# EAGLE design SparkFun_ENS160_BME280_Breakout (EAGLE 9.6.2)
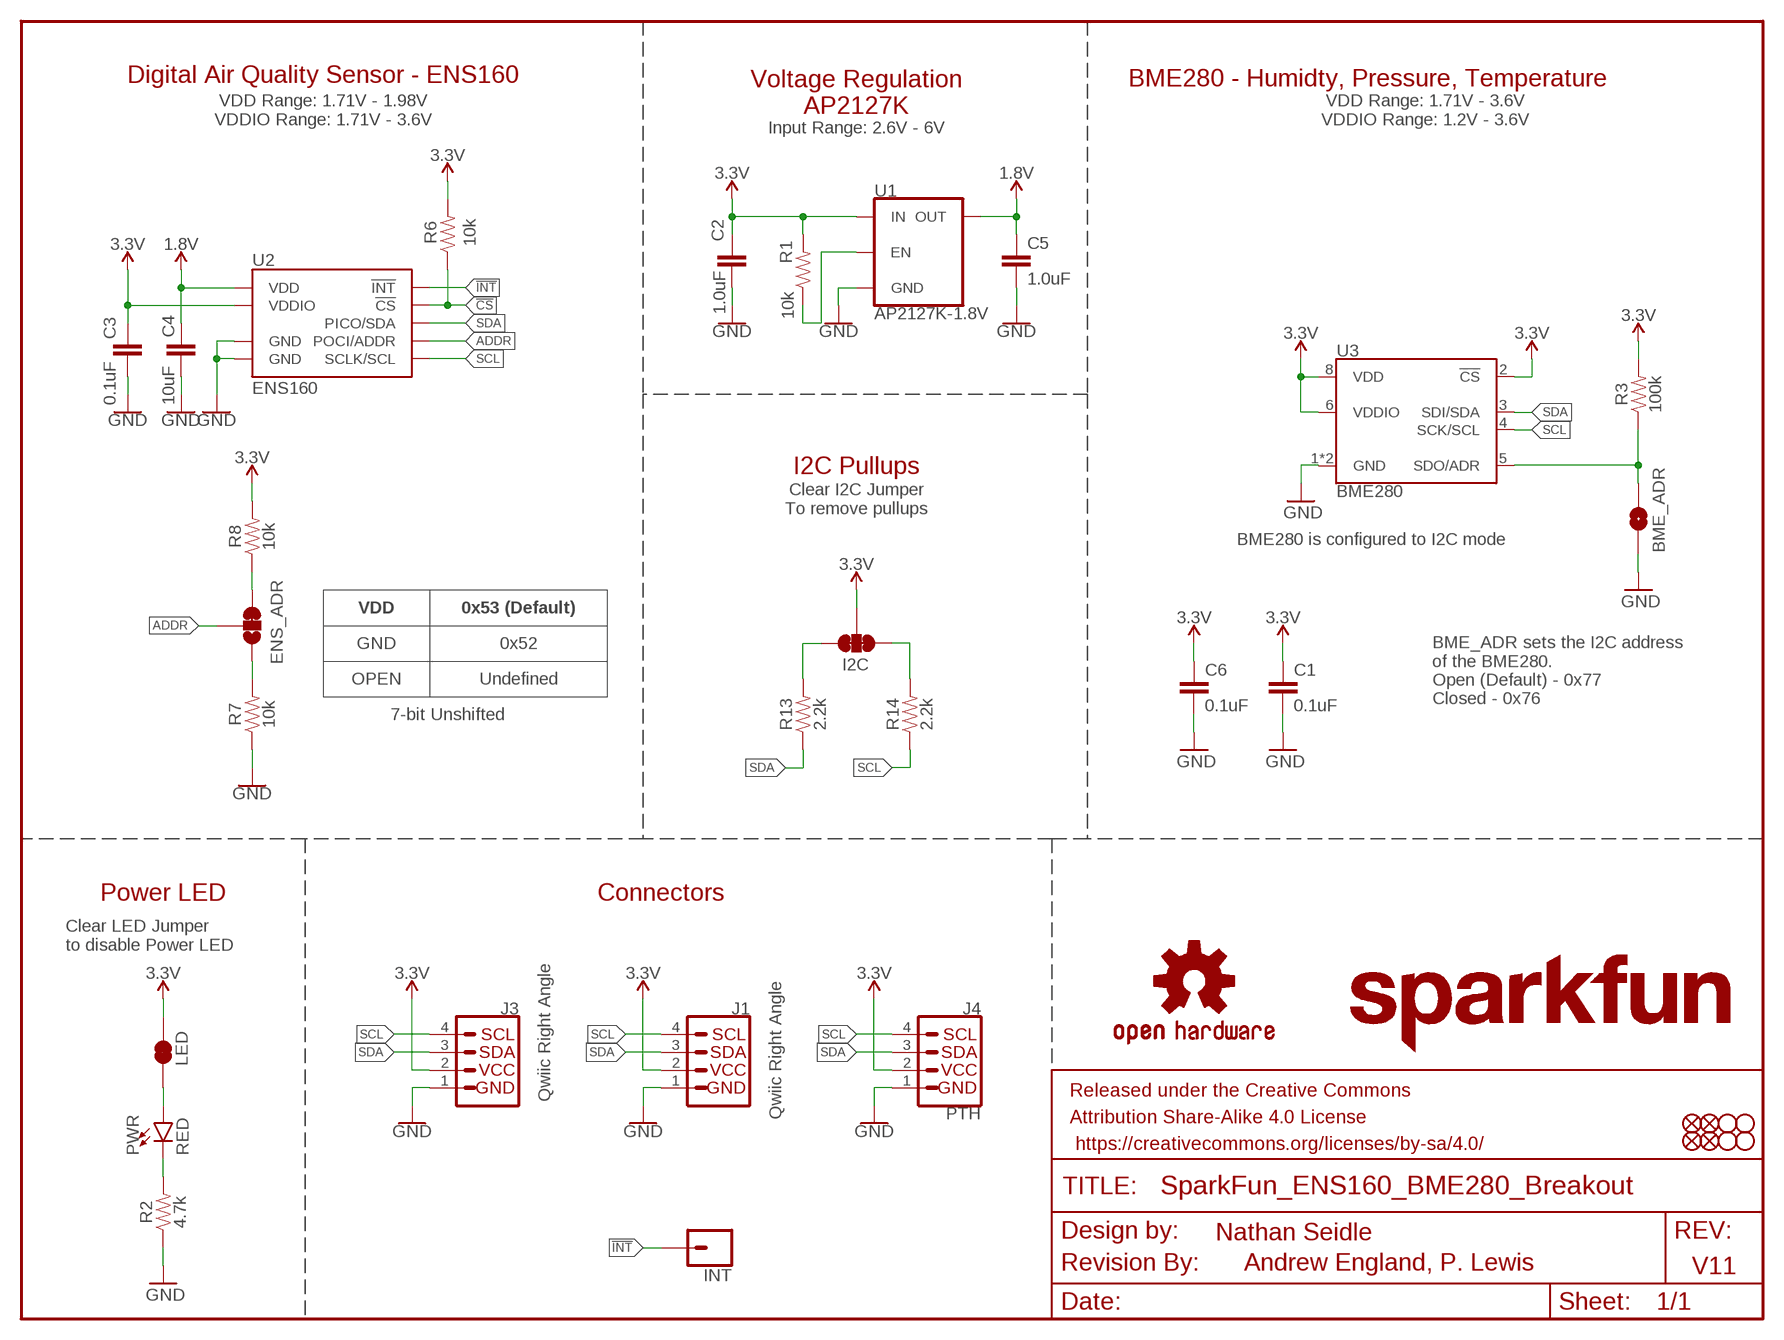
[diagram p0: schematic, sheet 1]

## Parts
BME_ADR  JUMPER-SMT_2_NO_SILK  [SMT-JUMPER_2_NO_SILK]
C1  0.1uF  0.1UF-0402T-16V-10%  [0402-TIGHT]
C2  1.0uF  1.0UF-0402T-16V-10%  [0402-TIGHT]
C3  0.1uF  0.1UF-0402T-16V-10%  [0402-TIGHT]
C4  10uF  10UF-0402T-6.3V-20%  [0402-TIGHT]
C5  1.0uF  1.0UF-0402T-16V-10%  [0402-TIGHT]
C6  0.1uF  0.1UF-0402T-16V-10%  [0402-TIGHT]
ENS_ADR  JUMPER-SMT_3_1-NC_TRACE_SILK  [SMT-JUMPER_3_1-NC_TRACE_SILK]
FD1  FIDUCIAL1X2  [FIDUCIAL-1X2]
FD2  FIDUCIAL1X2  [FIDUCIAL-1X2]
FD3  FIDUCIAL1X2  [FIDUCIAL-1X2]
FD4  FIDUCIAL1X2  [FIDUCIAL-1X2]
FRAME1  FRAME-LETTER  [CREATIVE_COMMONS]
H1  STAND-OFF  [STAND-OFF]
H2  STAND-OFF  [STAND-OFF]
H3  STAND-OFF  [STAND-OFF]
H4  STAND-OFF  [STAND-OFF]
I2C  JUMPER-SMT_3_2-NC_TRACE_SILK  [SMT-JUMPER_3_2-NC_TRACE_SILK]
INT  CONN_01PTH_NO_SILK_STAND  [1X01_NO_SILK_STAND]
J1  Qwiic Right Angle  I2C_STANDARDQWIIC  [JST04_1MM_RA]
J3  Qwiic Right Angle  I2C_STANDARDQWIIC  [JST04_1MM_RA]
J4  PTH  I2C_STANDARD_NO_SILK  [1X04_NO_SILK]
LED  JUMPER-SMT_2_NC_TRACE_SILK  [SMT-JUMPER_2_NC_TRACE_SILK]
LOGO1  SFE_LOGO_NAME.1_INCH  [SFE_LOGO_NAME_.1]
LOGO2  REVISION  [REVISION]
LOGO4  OSHW-LOGOS  [OSHW-LOGO-S]
PWR  RED  LED-RED_0603-KB  [LED-0603]
R1  10k  10KOHM-0402T-1/16W-1%  [0402-TIGHT]
R2  4.7k  4.7KOHM-0402T-1/16W-1%  [0402-TIGHT]
R3  100k  100KOHM-0402T-1/16W-1%  [0402-TIGHT]
R6  10k  10KOHM-0402T-1/16W-1%  [0402-TIGHT]
R7  10k  10KOHM-0402T-1/16W-1%  [0402-TIGHT]
R8  10k  10KOHM-0402T-1/16W-1%  [0402-TIGHT]
R13  2.2k  2.2KOHM-0402T-1/16W-1%  [0402-TIGHT]
R14  2.2k  2.2KOHM-0402T-1/16W-1%  [0402-TIGHT]
U1  AP2127K-1.8V  V_REG_AP2127K-1.8V  [SOT23-5]
U2  ENS160  ENS-160  [LGA-9]
U3  BME280  [LGA-8-2.5X2.5]

## Nets
1.8V: C4.1 C5.1 U1.5(OUT) U2.P4(VDD)
3.3V: C1.1 C2.1 C3.1 C6.1 I2C.2 J1.2 J3.2 J4.2 LED.1 R1.2 R3.2 R6.2 R8.2 U1.1(IN) U2.P5(VDDIO) U3.2(!CS) U3.6(VDDIO) U3.8(VDD)
!CS!: R6.1 U2.P7(!CS!)
!INT!: INT.1 U2.P6(!INT!)
ADDR: ENS_ADR.2 U2.P3(POCI/ADDR)
GND: BME_ADR.1 C1.2 C2.2 C3.2 C4.2 C5.2 C6.2 J1.1 J3.1 J4.1 R2.1 R7.1 U1.2(GND) U2.P8(GND) U2.P9(GND) U3.1(GND) U3.7(GND)
N$2: ENS_ADR.3 R8.1
N$3: R1.1 U1.3(EN)
N$4: I2C.3 R13.2
N$5: I2C.1 R14.2
N$6: PWR.C R2.2
N$7: ENS_ADR.1 R7.2
N$8: LED.2 PWR.A
SCL: J1.4 J3.4 J4.4 R14.1 U2.P2(SCLK/SCL) U3.4(SCK/SCL)
SDA: J1.3 J3.3 J4.3 R13.1 U2.P1(PICO/SDA) U3.3(SDI/SDA)
SDO/ADR: BME_ADR.2 R3.1 U3.5(SDO/ADR)

## Notes on the sheet
- Digital Air Quality Sensor - ENS160
- BME280 - Humidty, Pressure, Temperature
- Voltage Regulation
  AP2127K
- VDD Range: 1.71V - 1.98V
  VDDIO Range: 1.71V - 3.6V
- VDD Range: 1.71V - 3.6V
  VDDIO Range: 1.2V - 3.6V
- Input Range: 2.6V - 6V
- I2C Pullups
- Clear I2C Jumper
  To remove pullups
- BME280 is configured to I2C mode
- VDD | 0x53 (Default)
- BME_ADR sets the I2C address
  of the BME280.
  Open (Default) - 0x77
  Closed - 0x76
- GND | 0x52
- OPEN | Undefined
- 7-bit Unshifted
- Power LED | Connectors
- Clear LED Jumper 
  to disable Power LED
- Nathan Seidle
- Andrew England, P. Lewis | V11

## Library data of the parts
BME_ADR = SparkFun-Jumpers:JUMPER-SMT_2_NO: Normally open jumper This jumper has two pads in close proximity to each other. Apply solder to close the connection. Round pads are easier to solder for beginners, but are a lot larger. SparkFun Product that uses the round pads: SparkFun EL Sequencer <https://www.sparkfun.com/products/12781>
C1 C3 C6 = SparkFun-Capacitors:0.1UF: 0.1µF ceramic capacitors A capacitor is a passive two-terminal electrical component used to store electrical energy temporarily in an electric field.; PROD_ID: CAP-12416
C2 C5 = SparkFun-Capacitors:1.0UF: 1µF ceramic capacitors A capacitor is a passive two-terminal electrical component used to store electrical energy temporarily in an electric field.; PROD_ID: CAP-12417
C4 = SparkFun-Capacitors:10UF: 10.0µF ceramic capacitors A capacitor is a passive two-terminal electrical component used to store electrical energy temporarily in an electric field.; PROD_ID: CAP-14848
ENS_ADR = SparkFun-Jumpers:JUMPER-SMT_3_1-NC_TRACE: Normally closed trace jumper (1 of 2 connections) This jumper has a trace between two pads so it's normally closed (NC). The other connection is normally open (NO). Use a razor knife to open the connection. For best results follow the IPC guidelines for cutting traces: Cutout at least 0.063 mm (0.005 in). Remove all loose material to clean up the cut area. Seal the cut with an approved epoxy. Reapply solder to reclose the connection, or to close the NO connection.
FD1-FD4 = SparkFun-Aesthetics:FIDUCIAL: Fiducial Alignment Points Point-of-reference for pick-and-place machines and other optical instruments.
FRAME1 = SparkFun-Aesthetics:FRAME-LETTER: Schematic Frame - Letter Standard 8.5x11 US Letter frame
H1-H4 = SparkFun-Hardware:STAND-OFF: Stand Off Drill holes for mechanically mounting via screws, standoffs, etc. Note: Use the keepout ring to avoid running the screw head into surrounding components. Variant Overviews STAND-OFF - Mechanical footprint for a #4 phillips button head screw. STAND-OFF-TIGHT - Mechanical footprint for a #4 phillips button head screw, Example SparkFun Products Screw - Phillips Head (1/4", 4-40, 10 pack) <https://www.sparkfun.com/products/10453> (PRT-10453) Screw - Phillips Head (1/2", 4-40, 10 pack) <https://www.sparkfun.com/products/10452> (PRT-10452) Screw - Phillips Head (3/4", 4-40, 10 pack) <https://www.sparkfun.com/products/10451> (PRT-10451) Screw - Phillips Head (1", 4-40, 10 pack) <https://www.sparkfun.com/products/10450> (PRT-10450)
I2C = SparkFun-Jumpers:JUMPER-SMT_3_2-NC_TRACE: Normally closed trace jumper (2 of 2 connections) This jumper has a trace between all three pads so they are normally closed (NC). Use a razor knife to open the connection(s). For best results follow the IPC guidelines for cutting traces: Cutout at least 0.063 mm (0.005 in). Remove all loose material to clean up the cut area. Seal the cut with an approved epoxy. Reapply solder to reclose the connection(s).
INT = SparkFun-Connectors:CONN_01: Single connection point. Often used as Generic Header-pin footprint for 0.1 inch spaced/style header connections On any of the 0.1 inch spaced packages, you can populate with these: Break Away Headers - Straight <https://www.sparkfun.com/products/116> (PRT-00116) Break Away Male Headers - Right Angle <https://www.sparkfun.com/products/553> (PRT-00553) Female Headers <https://www.sparkfun.com/products/115> (PRT-00115) Break Away Headers - Machine Pin <https://www.sparkfun.com/products/117> (PRT-00117) Break Away Female Headers - Swiss Machine Pin <https://www.sparkfun.com/products/743> (PRT-00743) This device is also useful as a general connection point to wire up your design to another part of your project. Our various solder wires solder well into these plated through hole pads. Hook-Up Wire - Assortment (Stranded, 22 AWG) <https://www.sparkfun.com/products/11375> (PRT-11375) Hook-Up Wire - Assortment (Solid Core, 22 AWG) <https://www.sparkfun.com/products/11367> (PRT-11367) View the entire wire category on our website here <https://www.sparkfun.com/categories/141> Special notes: SMTSO-256-ET is a "flush mount" nut for a 4-40 screw. We mostly use this on specialty testbeds; it is a nice way to connect hardware to your PCB at an adjustable hieght. Also note, the SNAP packages are for using a snappable style connector. We sell a baggie of snaps and they are also used on two LilyPad designs: Snap Assortment - 30 pack (male and female) <https://www.sparkfun.com/products/11347> (DEV-11347) LilyPad Arduino SimpleSnap <https://www.sparkfun.com/products/10941> (DEV-10941) LilyPad SimpleSnap Protoboard <https://www.sparkfun.com/products/10940> (DEV-10940)
J1 J3 = SparkFun-Connectors:I2C_STANDARD: SparkFun I2C Standard Pinout Header SparkFun has standardized on a pinout for all I2C based sensor breakouts. This pinout allows I2C boards to be plugged directly into the headers on Arduino Uno compatible boards, and to be daisy chained easily. Example SparkFun Products: SparkFun Atmospheric Sensor Breakout - BME280 <https://www.sparkfun.com/products/13676> SparkFun Altitude/Pressure Sensor Breakout - MPL3115A2 <https://www.sparkfun.com/products/11084> SparkFun TOF Range Finder Sensor - VL6180 <https://www.sparkfun.com/products/12785>; PROD_ID: CONN-13694
J4 = SparkFun-Connectors:I2C_STANDARD: SparkFun I2C Standard Pinout Header SparkFun has standardized on a pinout for all I2C based sensor breakouts. This pinout allows I2C boards to be plugged directly into the headers on Arduino Uno compatible boards, and to be daisy chained easily. Example SparkFun Products: SparkFun Atmospheric Sensor Breakout - BME280 <https://www.sparkfun.com/products/13676> SparkFun Altitude/Pressure Sensor Breakout - MPL3115A2 <https://www.sparkfun.com/products/11084> SparkFun TOF Range Finder Sensor - VL6180 <https://www.sparkfun.com/products/12785>
LED = SparkFun-Jumpers:JUMPER-SMT_2_NC_TRACE: Normally closed trace jumper This jumper has a trace between two pads so it's normally closed (NC). Use a razor knife to open the connection. For best results follow the IPC guidelines for cutting traces: Cutout at least 0.063 mm (0.005 in). Remove all loose material to clean up the cut area. Seal the cut with an approved epoxy. Reapply solder to reclose the connection.
LOGO1 = SparkFun-Aesthetics:SFE_LOGO_NAME: SparkFun Font Logo This is the SparkFun name logo. The logo on the schematic will always be the same size; the package variant is the height of the flame part of the logo (or the height the flame would be, if it were drawn). Default layer for the logo on the board is tSilk.
LOGO2 = SparkFun-Aesthetics:REVISION: "Revision By" Text Preceding text for revisor documentation. Includes schematic text on "symbols" layer, and board text on tDoc.
LOGO4 = SparkFun-Aesthetics:OSHW-LOGO: Open-Source Hardware (OSHW) Logo This logo indicates the piece of hardware it is found on incorporates a OSHW license and/or adheres to the definition of open source hardware found here: http://freedomdefined.org/OSHW
PWR = SparkFun-LED:LED-RED: Red SMD LED Used in manufacturing of most products at SparkFun Packages: 0603 - KB - KingBright (DIO-17976) SMD 0603 package [Datasheet] <https://www.kingbrightusa.com/images/catalog/SPEC/APT1608SURCK.pdf> 0603 - (DIO-00819, has gone EOL) SMD 0603 package 0603 SMART - SMD 0603 SMART package ( more efficient and expensive)[Product Link] <http://www.osram-os.com/Graphics/XPic2/00077099_0.pdf> 1206 - SMD1206 package [Product Link] <https://www.sparkfun.com/datasheets/DevTools/LilyPad/Q150OVS4.pdff> SparkFun Products: Pro Mini 328 -5V <https://www.sparkfun.com/products/821> RedBoard <https://www.sparkfun.com/products/12757> IOIO-OTG <https://www.sparkfun.com/products/13613>; PROD_ID: DIO-17976
R1 R6-R8 = SparkFun-Resistors:10KOHM: 10kΩ resistor A resistor is a passive two-terminal electrical component that implements electrical resistance as a circuit element. Resistors act to reduce current flow, and, at the same time, act to lower voltage levels within circuits. - Wikipedia; PROD_ID: RES-14241
R2 = SparkFun-Resistors:4.7KOHM: 4.7kΩ resistor A resistor is a passive two-terminal electrical component that implements electrical resistance as a circuit element. Resistors act to reduce current flow, and, at the same time, act to lower voltage levels within circuits. - Wikipedia; PROD_ID: RES-15343
R3 = SparkFun-Resistors:100KOHM: 100kΩ resistor A resistor is a passive two-terminal electrical component that implements electrical resistance as a circuit element. Resistors act to reduce current flow, and, at the same time, act to lower voltage levels within circuits. - Wikipedia; PROD_ID: RES-13495
R13 R14 = SparkFun-Resistors:2.2KOHM: 2.2kΩ resistor A resistor is a passive two-terminal electrical component that implements electrical resistance as a circuit element. Resistors act to reduce current flow, and, at the same time, act to lower voltage levels within circuits. - Wikipedia; PROD_ID: RES-14341
U1 = SparkFun-IC-Power:V_REG_AP2127: AP2127 - 300mA CMOS LDO Regulator w/ Enable The AP2127 is CMOS process low dropout linear regulator with enable function, the regulator delivers a guaranteed 300mA (min.) continuous load current. Features Output Voltage Accuracy: ±1.5% Output Current: 300mA (Min.) Foldback Short Current Protection: 50mA Enable Function to Turn ON/OFF VOUT Low Dropout Voltage (3.3V): 250mV (Typ.) @IOUT=600mA Excellent Load Regulation: 0.2%/A (Typ.) Excellent Line Regulation: 0.02%/V (Typ.) Low Quiescent Current: 55μA (Typ.) Low Standby Current: 0.01μA (Typ.) Low Output Noise: 50μVRMS PSRR: 100Hz -65dB, 1kHz -65dB OTSD Protection Stable with 1.0μF Flexible Cap: Ceramic, Tantalum and Aluminum Electrolytic Operation Temperature Range: -40°C to 85°C ESD: MM 400V, HBM 4000V; PROD_ID: VREG-14239
U2 = SparkFun-Sensors:ENS-160: ScioSense Indoor Air Quality Sensor - ENS160 The ENS160 is a digital multi-gas sensor solution, based on metal oxide (MOX) technology with four sensor elements. The independent hotplate control allows the detection of a wide range of volatile organic compounds (VOCs) including ethanol, toluene, hydrogen and oxidizing gases with superior sensitivity. The ENS160 supports intelligent algorithms to process raw sensor measurements on-chip. These algorithms calculate CO2-equivalents, TVOC, air quality indices (AQIs) and perform humidity and temperature compensation, as well as baseline management, all on chip.; PROD_ID: IC-17100
U3 = SparkFun-Sensors:BME280: Bosch BME280 – Combined Humidity and Pressure Sensor The BME280 is as combined digital humidity, pressure and temperature sensor based on proven sensing principles. The sensor module is housed in an extremely compact metal-lid LGA package with a footprint of only 2.5×2.5mm² with a height of 0.93mm. Its small dimensions and its low power consumption allow the implementation in battery driven devices such as handsets, GPS modules or watches. Datasheet <https://cdn.sparkfun.com/assets/learn_tutorials/4/1/9/BST-BME280_DS001-10.pdf> SparkFun Products SparkFun Atmospheric Sensor Breakout - BME280 <https://www.sparkfun.com/products/13676> (SEN-13676); PROD_ID: IC-13090

## Board
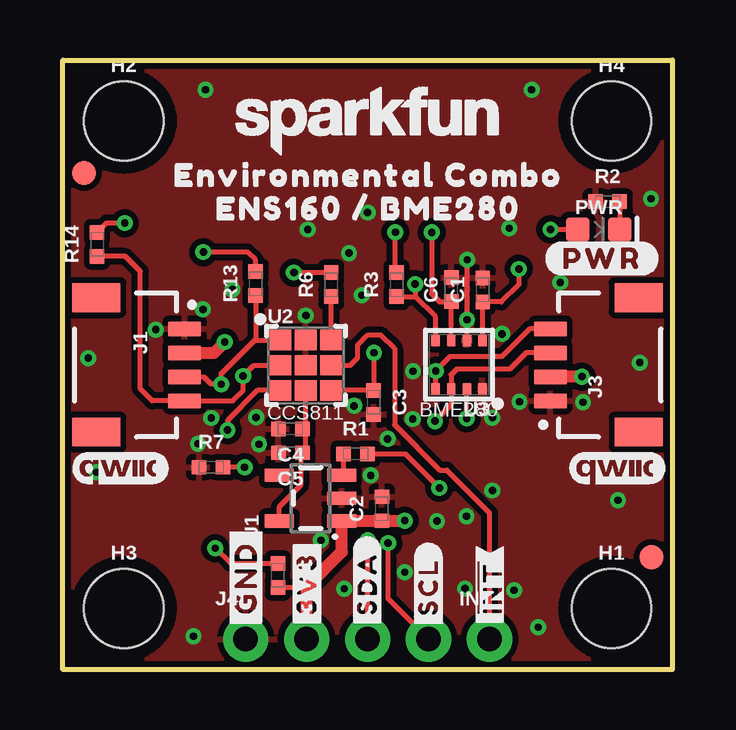
[diagram p1: board, top side]
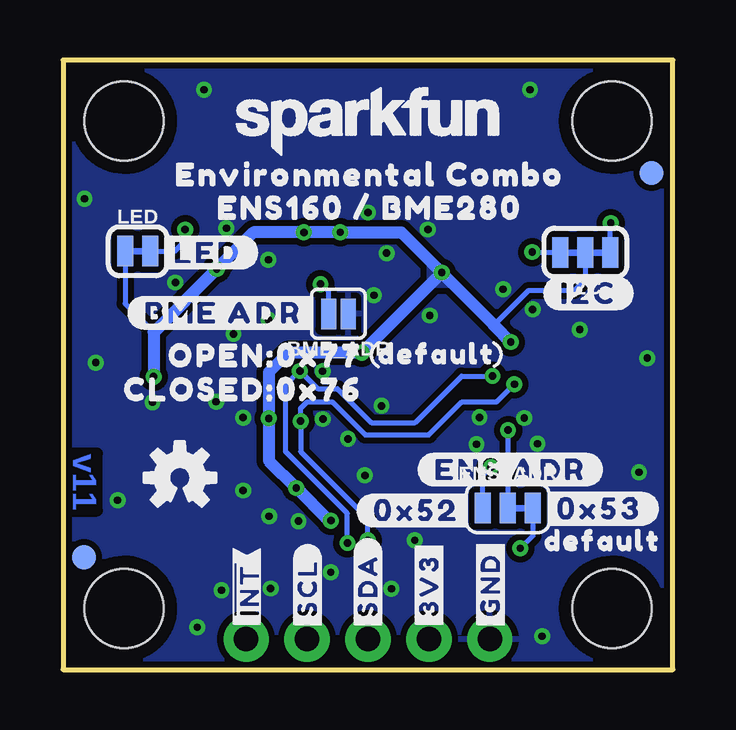
[diagram p2: board, bottom side, seen from below]

Size 25.4 x 25.4 mm. Coordinates in mm from the lower left corner, seen from the top.
Outline: 0,0 0,25.4 25.4,25.4 25.4,0 0,0
Copper layers (1*16): Top 0.035mm / dielectric 1.5mm / Bottom 0.035mm
Design rules "SparkFun-2-Layer-General-JLCPCB": minimum track width 7mil, minimum drill 0.3mm, track to track 7mil, track to pad 7mil, pad to pad 7mil, via to via 7mil, smd to smd 7mil, copper to edge 7mil, drill to drill 7mil, minimum pad ring 7mil, minimum via ring 7mil, stop-mask expansion 3mil, vias tented up to drill 25mil, thermal gap 10mil

### Footprints (pad centres in the part's own frame; a part is rotated, then mirrored left to right if it is on the bottom)
SMT-JUMPER_2_NO_SILK = smd 0.635 x 1.27: 1 -0.406,0; 2 0.406,0
0402-TIGHT = smd 0.6 x 0.6: 1 -0.5,0; 2 0.5,0
SMT-JUMPER_3_1-NC_TRACE_SILK = smd 0.66 x 1.27: 1 -1.041,0; 2 0,0; 3 1.041,0
FIDUCIAL-1X2 = smd 1 x 1: 1 0,0
STAND-OFF = hole 3.302: 0,0
SMT-JUMPER_3_2-NC_TRACE_SILK = smd 0.66 x 1.27: 1 -1.041,0; 2 0,0; 3 1.041,0
1X01_NO_SILK_STAND = drill 1.016 pad 1.88: 1 0,0
JST04_1MM_RA = smd 0.6 x 1.35: 1 -1.5,0; 2 -0.5,0; 3 0.5,0; 4 1.5,0 | smd 1.2 x 2: NC1 2.8,-3.675; NC2 -2.8,-3.675
1X04_NO_SILK = drill 1.016 pad 1.88: 1 0,0; 2 2.54,0; 3 5.08,0; 4 7.62,0
SMT-JUMPER_2_NC_TRACE_SILK = smd 0.66 x 1.27: 1 -0.521,0; 2 0.521,0
LED-0603 = smd 1 x 1: A -0.877,0; C 0.877,0
SOT23-5 = smd 0.55 x 1.2: 1 -0.95,-1.3; 2 0,-1.3; 3 0.95,-1.3; 4 0.95,1.3; 5 -0.95,1.3
LGA-9 = smd 0.9 x 0.85: P1 -1.085,1.03; P2 -1.085,-0.02; P3 -1.085,-1.07; P4 -0.035,-1.07; P5 1.015,-1.07; P6 1.015,-0.02; P7 1.015,1.03; P8 -0.035,1.03; P9 -0.035,-0.02
LGA-8-2.5X2.5 = smd 0.35 x 0.5: 1 -0.975,1.025; 2 -0.325,1.025; 3 0.325,1.025; 4 0.975,1.025; 5 0.975,-1.025; 6 0.325,-1.025; 7 -0.325,-1.025; 8 -0.975,-1.025

### Placement (x,y rotation side)
BME_ADR  13.93,14.83 180 bottom
C1  17.5,15.82 90 top
C2  13.29,6.7 90 top
C3  12.95,11.14 270 top
C4  9.49,10.03 180 top
C5  9.48,9.03 180 top
C6  16.2,15.83 90 top
ENS_ADR  6.88,6.73 0 bottom
FD1  0.88,20.69 0 top
FD2  24.53,4.68 0 top
FD3  24.53,4.68 0 bottom
FD4  0.88,20.69 0 bottom
FRAME1  -13.97,-21.59 0 top  (outside the outline)
H1  22.86,2.54 0 top
H2  2.54,22.86 0 top
H3  2.54,2.54 0 top
H4  22.86,22.86 0 top
I2C  3.64,17.38 180 bottom
INT  17.78,1.27 0 top
J1  5.08,12.7 270 top
J3  20.32,12.7 90 top
J4  7.62,1.27 0 top
LED  22.3,17.43 0 bottom
LOGO1  12.7,22.86 0 top
LOGO2  -2.54,-24.13 0 top  (outside the outline)
LOGO3  SFE_LOGO_NAME.1_INCH  [SFE_LOGO_NAME_.1@1]  18.67,20.94 0 bottom
LOGO4  20.54,8 0 bottom
PWR  22.33,18.34 0 top
R1  12.2,8.99 0 top
R2  22.7,19.5 0 top
R3  13.91,16.04 90 top
R6  11.19,16.04 90 top
R7  6.18,8.43 0 top
R8  8.96,3.92 270 top
R13  8.04,16.08 90 top
R14  1.43,17.72 90 top
U1  10.33,7.14 90 top
U2  10.16,12.7 0 top
U3  16.51,12.7 180 top
U$1  [#BME_ADR#0]  18.74,14.86 0 bottom
U$2  [#0X53#0]  3.06,6.7 0 bottom
U$3  [#0X52#0]  10.69,6.63 0 bottom
U$4  [##INT##6]  17.75,3.33 90 bottom
U$5  [#ENS_ADR#0]  6.77,8.33 0 bottom
U$6  [#I2C#0]  3.51,15.67 0 bottom
U$7  [ENVIRONMENTAL_COMBO0]  12.73,20.6 0 top
U$8  [#SCL#4]  15.21,3.4 90 bottom
U$9  [#GND#2]  7.59,3.53 90 bottom
U$10  [ENS160_#_BME2800]  12.73,19.21 0 top
U$11  [ENVIRONMENTAL_COMBO0]  12.63,20.62 0 bottom
U$12  [ENS160_#_BME2800]  12.63,19.23 0 bottom
U$13  [DEFAULT0]  2.92,5.37 0 bottom
U$14  [#SDA#3]  12.7,3.52 90 bottom
U$15  [#PWR#0]  22.46,17.13 0 top
U$16  [OPEN#0X770]  16.97,13.08 0 bottom
U$17  [CLOSED#0X760]  17.91,11.67 0 bottom
U$18  [#LED#0]  19.39,17.38 0 bottom
U$20  [QWIIC_4MM]  23.11,8.38 0 top
U$21  [QWIIC_4MM]  2.41,8.38 0 top
U$27  [#3V3#874]  10.15,3.51 90 bottom
U$45  [#GND#864]  7.63,3.82 90 top
U$46  [#3V3#874]  10.18,3.58 90 top
U$47  [#SDA#874]  12.68,3.59 90 top
U$48  [#SCL#875]  15.23,3.45 90 top
U$51  [##INT##877]  17.79,3.41 90 top
U$59  [ORDERING_INSTRUCTIONS]  44.45,50.8 0 top  (outside the outline)
U$61  [DEFAULT0]  9.84,13.15 0 bottom

### Tracks (layer width: path | path; a pad name or v marks a point on that pad's centre or on a via)
1.8V
  Top 0.203: U1.5 9.03,6.79 9.91,7.68 9.91,8.96 C5.1 10.11,9.16 10.11,9.91 C4.1 10.12,10.17 U2.P4
3.3V  (via drill 0.3)
  Top 0.203: 12.95,13.19 C3.1 U2.P5 | v16.84,10.47 U3.2 | v16.84,10.47 | v19,16.69 19,16.05 18.28,15.32 C1.1 17.48,15.3 U3.8 | R8.2 10.14,3.42 10.16,3.44 | U3.6 16.18,15.32 | 16.18,15.32 C6.1 | v15.37,18.22 15.37,15.65 15.7,15.32 16.18,15.32 | R3.2 13.86,16.59 v13.86,18.22 | R1.2 14.28,8.99 v15.69,7.57 | R6.2 v9.63,16.54
  Top 0.508: J1.2 6.3,13.2 v6.75,13.65 | v12.97,13.21 12.95,13.19 | U2.P5 | v21.63,12.21 v21.63,12.2 J3.2 | v14.25,6.21 v14.24,6.2 C2.1 U1.1 11.62,4.9 10.16,3.44 J4.2
  Bottom 0.203: I2C.2 3.65,16.25 4.11,15.79 6.01,15.79 7.45,14.36 7.45,14.34 | 21.63,14.06 22.82,15.25 LED.1
  Bottom 0.508: v21.63,12.21 21.63,14.06 v19,16.69 17.48,18.22 v15.37,18.22 v13.86,18.22 11.31,18.22 v9.63,16.54 | v14.25,6.21 14.33,6.21 v15.69,7.57 16.84,8.71 v16.84,10.47 16.84,12.39 16.02,13.21 v12.97,13.21 v9.63,16.54 | v6.75,13.65 7.45,14.34 9.63,16.53 v9.63,16.54 | v9.63,16.54
  pour Bottom (no thermals): 10.18,17.06 10.18,16.01 9.13,16.01
!CS!
  Top 0.203: U2.P7 R6.1
!INT!
  Top 0.203: U2.P6 11.97,12.68 12.28,12.99 12.28,13.52 12.71,13.95 13.26,13.95 13.82,13.38 13.82,10.2 15.71,8.31 16,8.31 17.78,6.53 INT.1
ADDR  (via drill 0.3)
  Top 0.203: U2.P3 8.11,11.63 6.87,10.39 v6.87,9.98
  Bottom 0.203: v6.87,9.98 v6.88,9.97 ENS_ADR.2
GND  (via drill 0.3)
  Top 0.203: v16.85,17.07 16.84,17.06 U3.7
  other vias: 6.19,10.49 14.58,10.44 14.59,12.43 7.07,15.84 5.84,15.01 21.68,11.14 19.03,11.16 17.9,10.5 13.54,9.61 8.18,9.39 15.59,6.19 5.64,9.41 3.87,14.17 5.95,24.16 19.54,24.16 23.13,7.06 24.51,19.62 19.81,1.77 5.45,1.39 1.41,8.22 1.06,12.98 24.04,12.79 11.93,17.35 12.45,15.6 14.25,4.05 11.72,3.37 12.83,8.09 10.13,14.75 16.84,14.58 10.21,18.34 18.6,18.39 12.7,19.04 20.73,16.13 18.31,13.99 8.06,10.51 12.14,10.99 17.9,7.46 16.82,6.39 18.81,3.31 16.76,3.38 10.75,5.39
  pour Top (isolate 0.254, rank 3): 0,0 25.4,0 25.4,25.4 0,25.4
  pour Bottom (isolate 0.254, rank 3): 0,25.4 25.4,25.4 25.4,0 0,0
N$2  (via drill 0.3)
  Top 0.203: v6.36,5.06 7,4.42 R8.1
  Bottom 0.203: ENS_ADR.3 5.83,5.57 v6.35,5.05 v6.36,5.06
N$3
  Top 0.203: U1.3 11.7,8.09 R1.1
N$4  (via drill 0.3)
  Top 0.203: R13.2 8.04,17.07 7.71,17.4 v5.86,17.4
  Bottom 0.203: I2C.3 5.83,17.38 v5.86,17.4
N$5  (via drill 0.3)
  Top 0.203: v2.59,18.61 1.81,18.61 R14.2
  Bottom 0.203: I2C.1 2.6,18.59 v2.59,18.61
N$6
  Top 0.203: R2.2 PWR.C
N$7  (via drill 0.3)
  Top 0.203: v7.58,8.43 R7.2
  Bottom 0.203: ENS_ADR.1 7.92,8.1 v7.59,8.43 v7.58,8.43
N$8  (via drill 0.3)
  Top 0.203: PWR.A v20.32,18.34
  Bottom 0.203: LED.2 20.75,17.43 20.32,17.86 v20.32,18.34
SCL  (via drill 0.3)
  Top 0.203: U2.P2 7.96,12.68 v7.51,12.23 7.51,11.62 7.09,11.2 J1.4 3.73,11.2 3.23,11.69 3.23,16.59 2.61,17.22 R14.1 | J3.4 19.45,14.2 18.29,13.04 16.13,13.04 v15.54,12.44 U3.4 | J4.4 13.56,2.95 v13.56,5.27
  Bottom 0.203: v7.51,12.23 v7.52,12.23 8.8,12.23 10.74,10.29 12.56,10.29 13.98,11.71 14.8,11.71 v15.54,12.44 16.13,11.85 16.13,9.08 13.56,6.5 v13.56,5.27
SDA  (via drill 0.3)
  Top 0.203: J1.3 5.87,12.2 6.18,11.89 v6.6,11.89 6.6,12.34 8,13.73 8.04,13.73 | 8.04,13.73 U2.P1 | J3.3 19.31,13.2 18.63,12.52 16.41,12.52 16.18,12.29 U3.3 16.18,11.03 v15.51,10.35 | R13.1 8.04,13.74 8.04,13.73 | J4.3 v12.7,5.38 v12.71,5.39
  Bottom 0.203: v6.6,11.89 7.34,11.16 8.79,11.16 10.16,9.78 12.82,9.78 14.19,11.16 15.23,11.16 15.51,10.88 v15.51,10.35 15.51,9.08 12.71,6.28 v12.71,5.39
SDO/ADR  (via drill 0.3)
  Top 0.203: U3.5 15.54,14.7 14.69,15.54 14.68,15.54 | R3.1 14.68,15.54 | v14.68,16.06 14.68,15.54
  Bottom 0.203: BME_ADR.2 14.34,15.73 14.67,16.06 v14.68,16.06

### Text on the board
Bottom: v11
tNames: BME280 | CCS811
Measures: Measurements units: INCHES
tDocu: Soldermask: Red / Thickness: 1.6mm / 2-Layer Design / 1oz copper / Finish: HASL | Nathan Seidle | Andrew England, P. Lewis